# EAGLE design rgb_driver_double_layer (EAGLE 9.6.2)
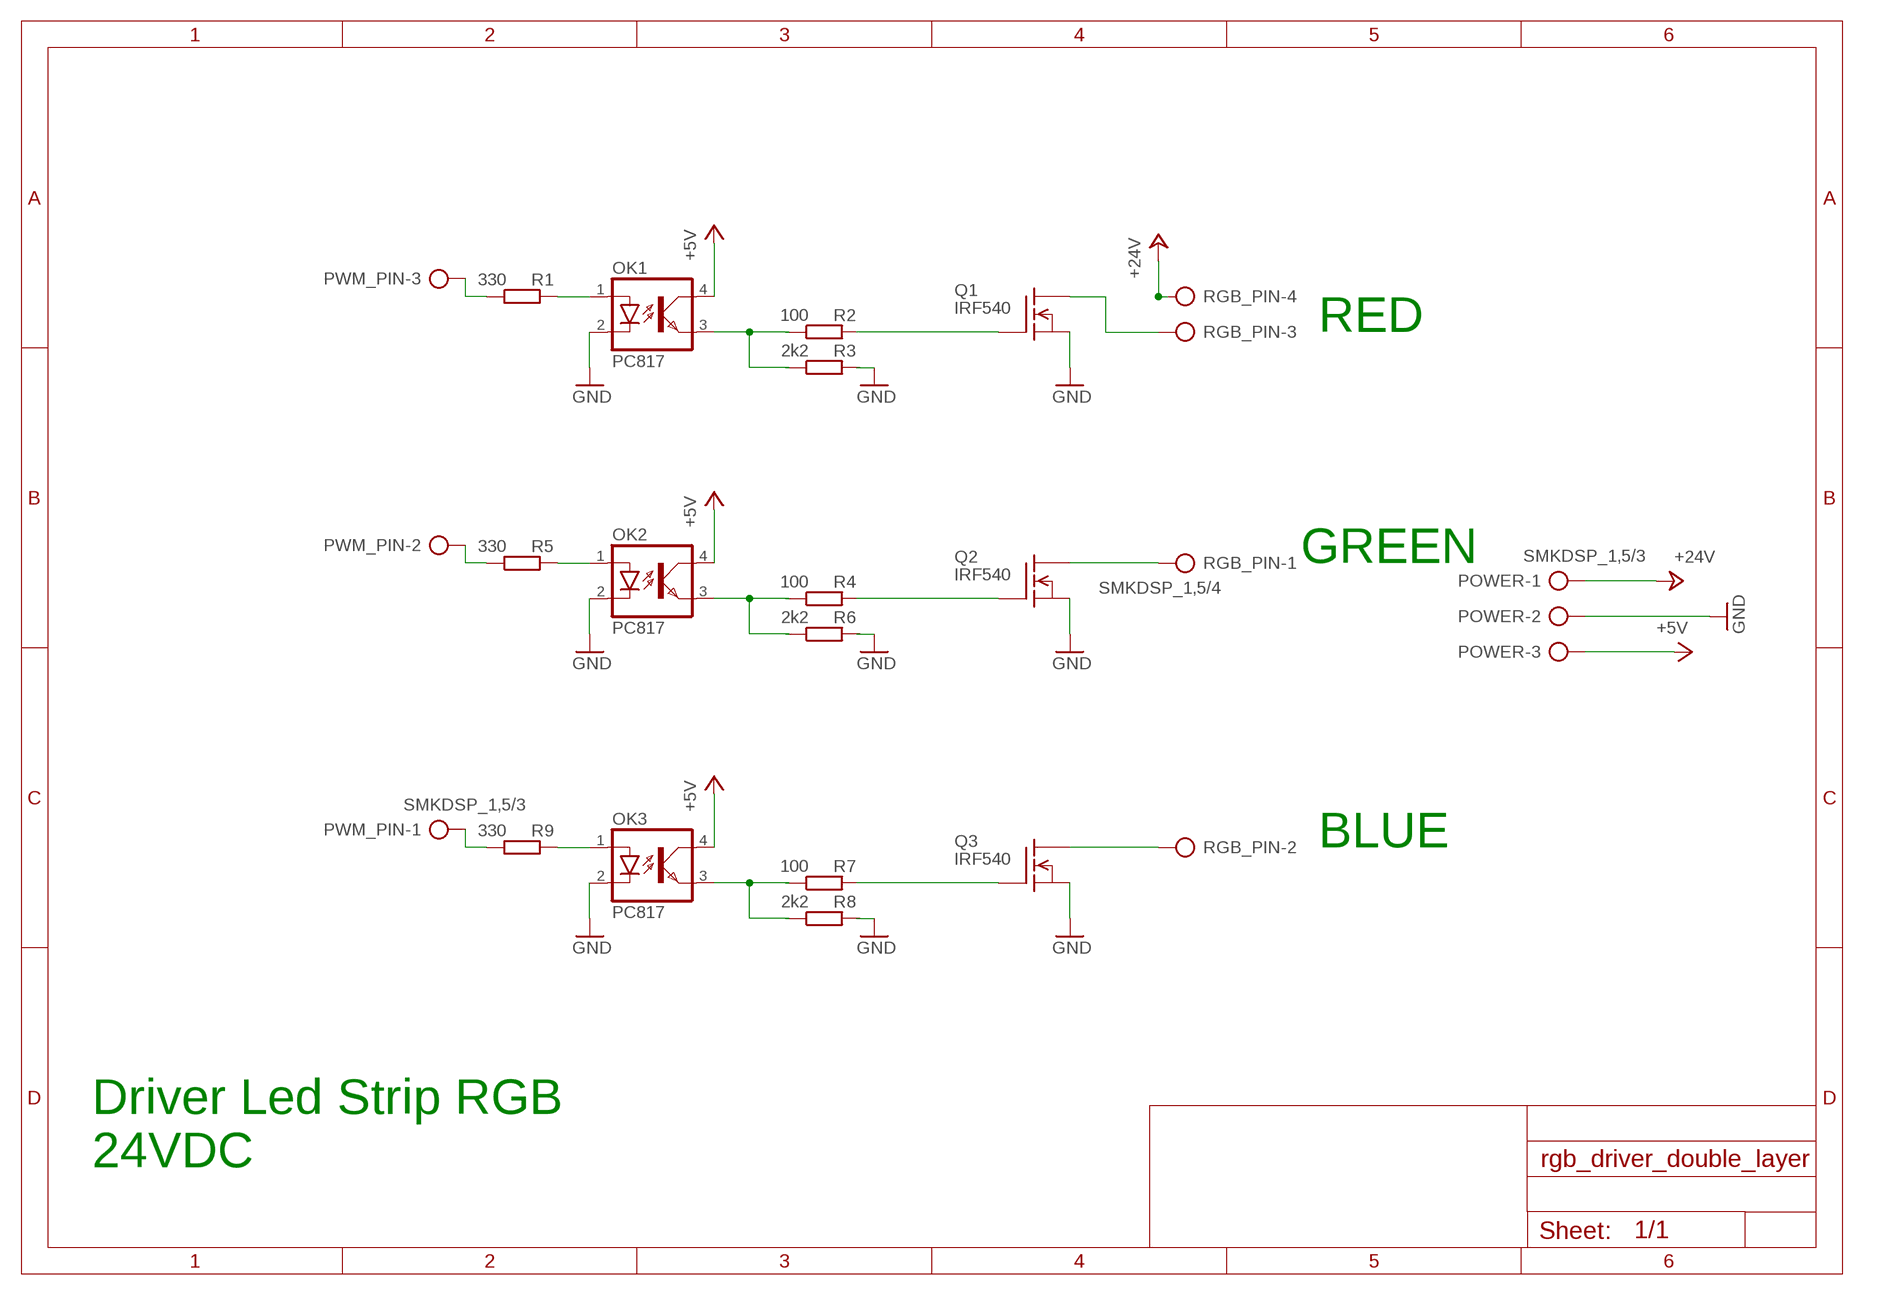
[diagram p0: schematic, sheet 1]

## Parts
OK1  PC817  [DIL04]
OK2  PC817  [DIL04]
OK3  PC817  [DIL04]
POWER  SMKDSP_1,5/3  [SMKDSP_1,5/3]
PWM_PIN  SMKDSP_1,5/3  [SMKDSP_1,5/3]
Q1  IRF540  [TO220]
Q2  IRF540  [TO220]
Q3  IRF540  [TO220]
R1  330  R-EU_0207/10  [0207/10]
R2  100  R-EU_0207/10  [0207/10]
R3  2k2  R-EU_0207/10  [0207/10]
R4  100  R-EU_0207/10  [0207/10]
R5  330  R-EU_0207/10  [0207/10]
R6  2k2  R-EU_0207/10  [0207/10]
R7  100  R-EU_0207/10  [0207/10]
R8  2k2  R-EU_0207/10  [0207/10]
R9  330  R-EU_0207/10  [0207/10]
RGB_PIN  SMKDSP_1,5/4  [SMKDSP_1,5/4]

## Nets
+5V: OK1.4(COL) OK2.4(COL) OK3.4(COL) POWER.3
+24V: POWER.1 RGB_PIN.4
BLUE_LED: Q3.2(D) RGB_PIN.2
GND: OK1.2(C) OK2.2(C) OK3.2(C) POWER.2 Q1.3(S) Q2.3(S) Q3.3(S) R3.2 R6.2 R8.2
GREEN_LED: Q2.2(D) RGB_PIN.1
N$1: OK1.3(EMIT) R2.1 R3.1
N$3: Q1.1(G) R2.2
N$5: OK2.3(EMIT) R4.1 R6.1
N$8: Q2.1(G) R4.2
N$11: OK3.3(EMIT) R7.1 R8.1
N$13: Q3.1(G) R7.2
N$16: OK1.1(A) R1.2
N$17: OK2.1(A) R5.2
N$18: OK3.1(A) R9.2
PWM_BLUE: PWM_PIN.1 R9.1
PWM_GREEN: PWM_PIN.2 R5.1
PWM_RED: PWM_PIN.3 R1.1
RED_LED: Q1.2(D) RGB_PIN.3

## Notes on the sheet
- RED
- GREEN
- BLUE
- Driver Led Strip RGB
- 24VDC

## Library data of the parts
OK1-OK3 = optocoupler:PC817: SHARP OPTO COUPLER; MPN: PC817X4J000F; OC_FARNELL: 9707727; OC_NEWARK: 97K7059
POWER PWM_PIN = con-phoenix-smkdsp:SMKDSP_1,5/3: Printklemme, Nennstrom: 17,5 A, Bemessungsspannung: 250 V, Raster: 5,0 mm Source: http://eshop.phoenixcontact.de .. 1733415.pdf; MF: FARNELL; MPN: 1733583; OC_FARNELL: 3041256; OC_NEWARK: 71C4130
Q1-Q3 = transistor-fet:IRF540: N-Channel Enhancement MOSFET (HEXFET); 100V; 28A; 0,077Ohm
R1-R9 = resistor:R-EU_: RESISTOR, European symbol
RGB_PIN = con-phoenix-smkdsp:SMKDSP_1,5/4: Printklemme, Nennstrom: 17,5 A, Bemessungsspannung: 250 V, Raster: 5,0 mm Source: http://eshop.phoenixcontact.de .. 1733415.pdf; MF: FARNELL; MPN: 1733596; OC_FARNELL: 3041268; OC_NEWARK: 71C4131

## Board
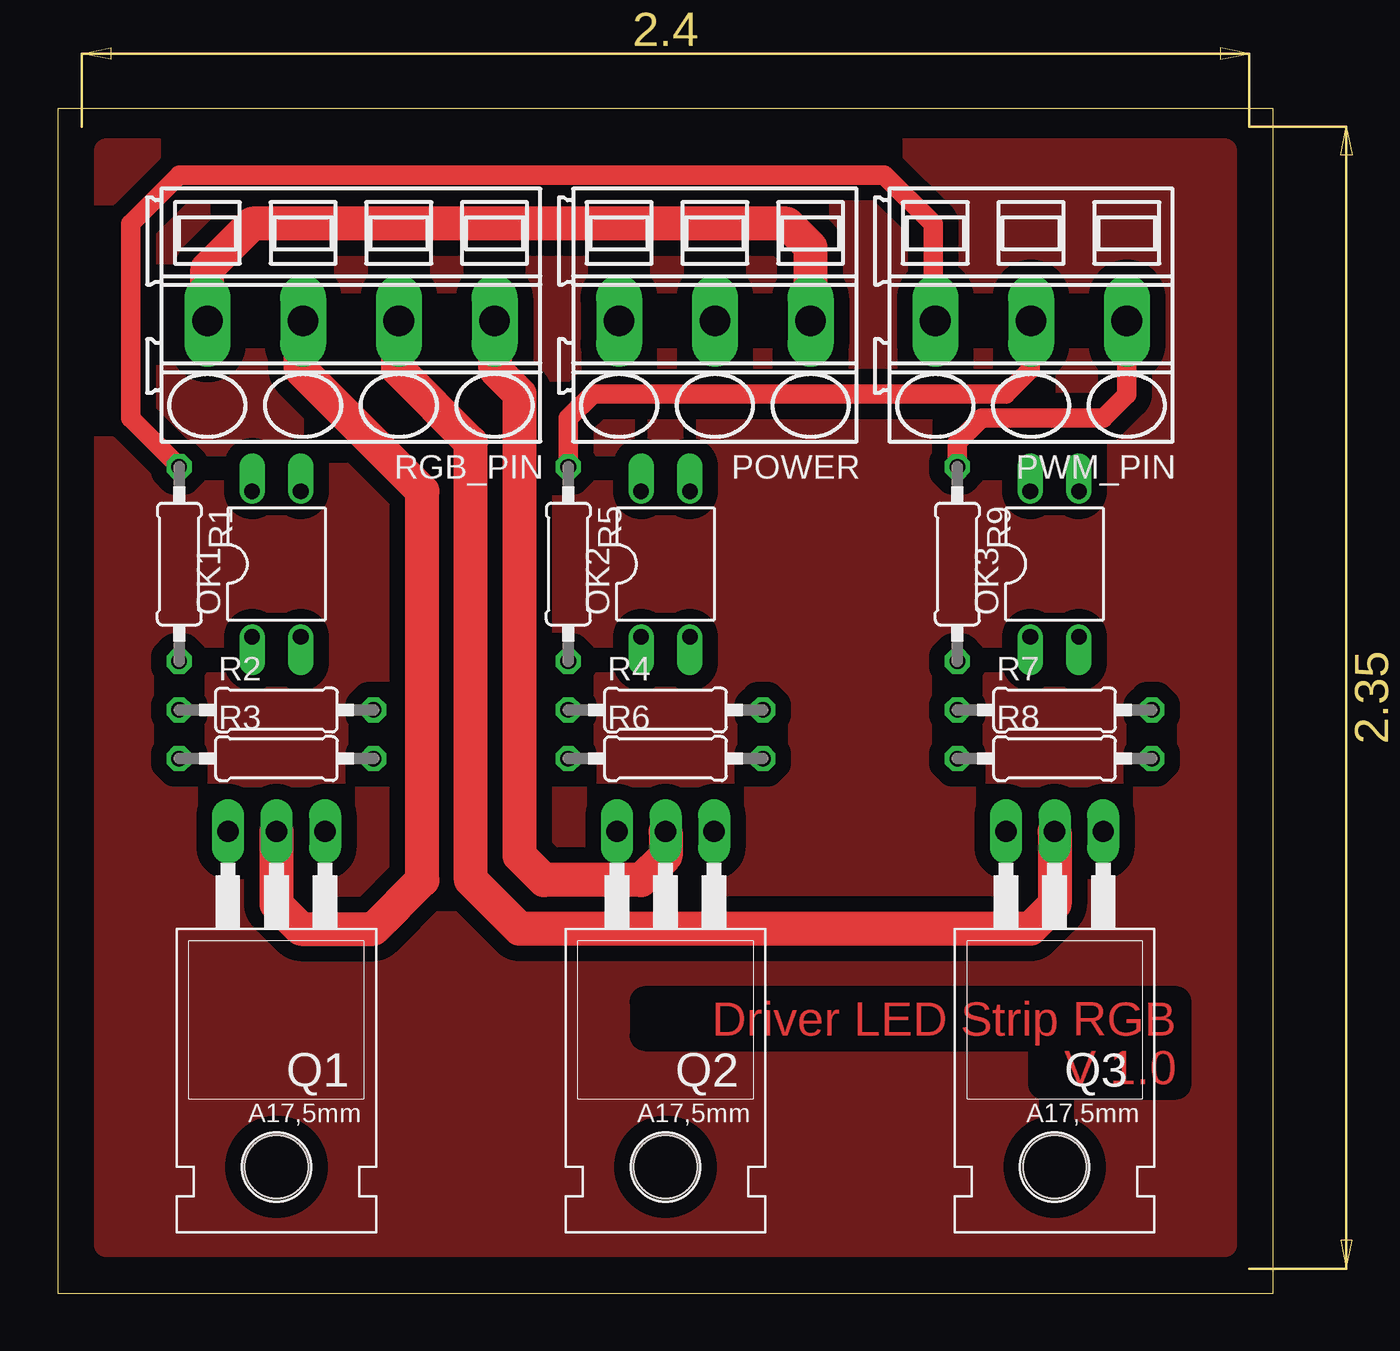
[diagram p1: board, top side]
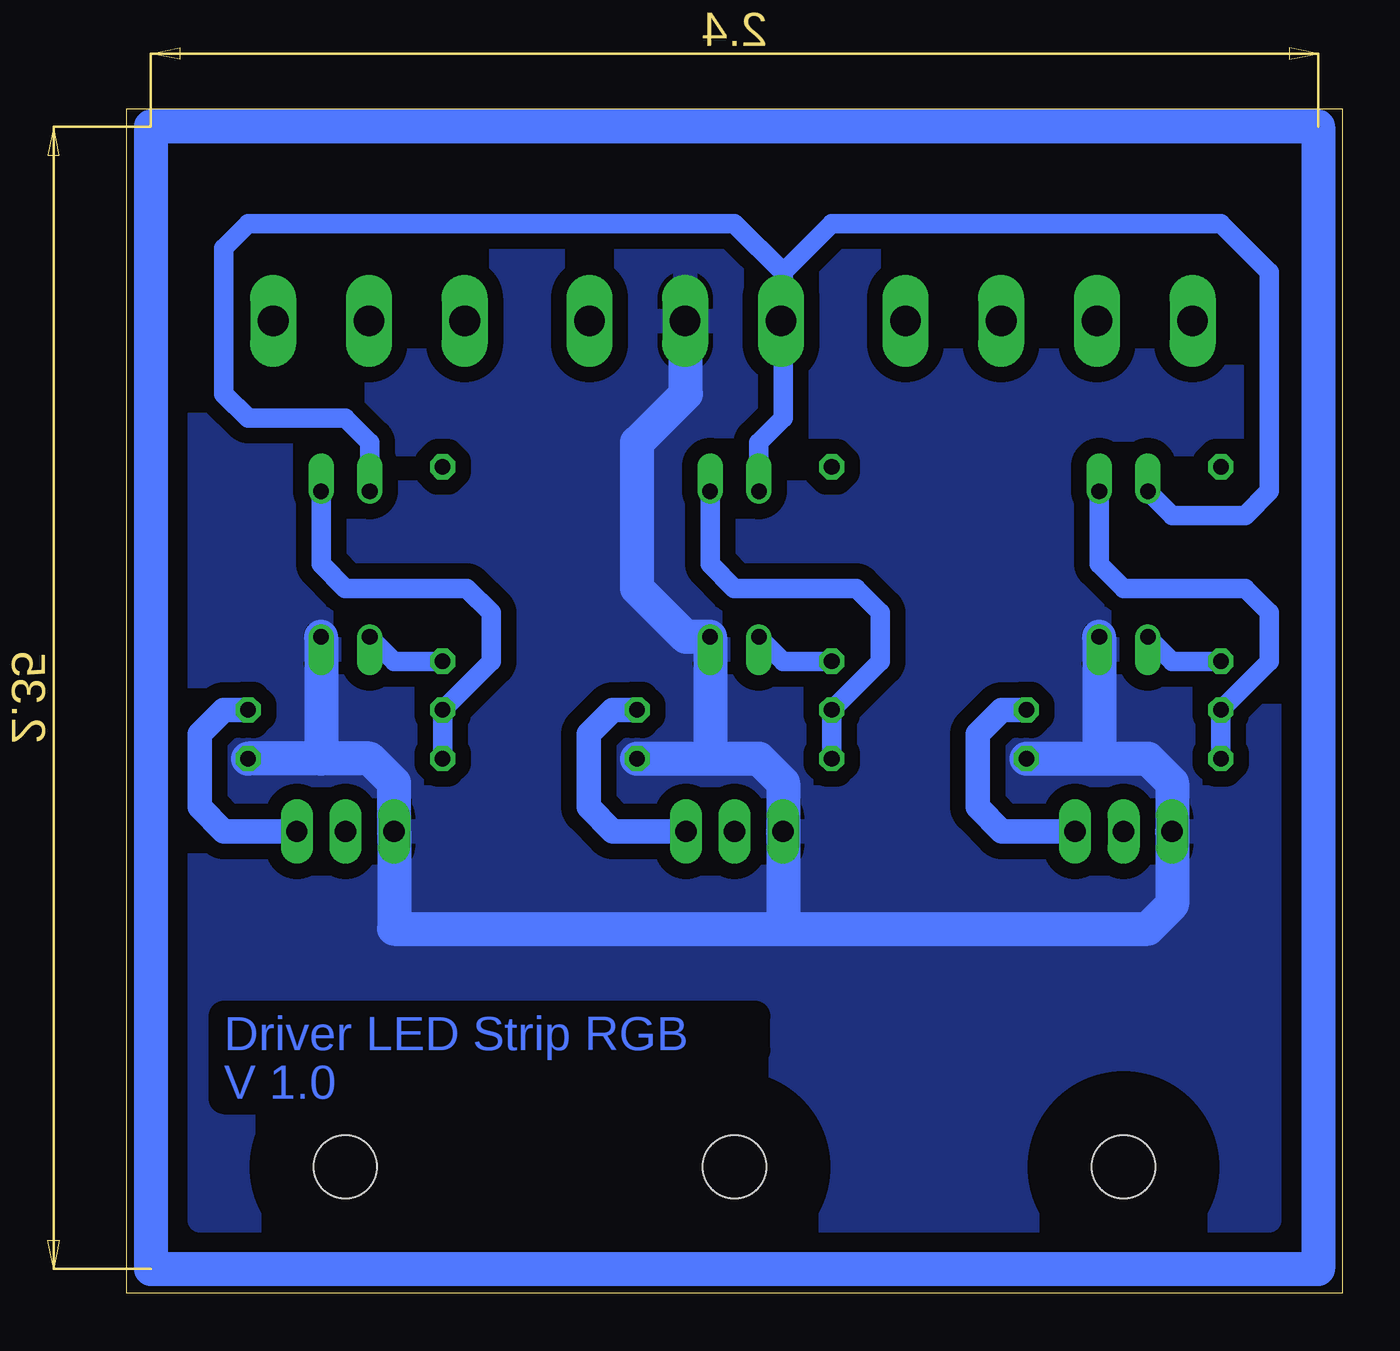
[diagram p2: board, bottom side, seen from below]

Size 63.48 x 61.9 mm. Coordinates in mm from the lower left corner, seen from the top.
Outline: 0,0 63.48,0 63.48,61.9 0,61.9 0,0
Copper layers (1*16): Top 0.035mm / dielectric 1.5mm / Bottom 0.035mm
Design rules "default": minimum track width 10mil, minimum drill 24mil, track to track 8mil, track to pad 8mil, pad to pad 8mil, via to via 8mil, smd to smd 8mil, copper to edge 40mil, drill to drill 8mil, minimum pad ring 10mil, minimum via ring 8mil, stop-mask expansion 4mil, vias tented up to drill 0mil, thermal gap 10mil

### Footprints (pad centres in the part's own frame; a part is rotated, then mirrored left to right if it is on the bottom)
DIL04 = drill 0.813 offset: 1 -1.27,-3.81; 2 1.27,-3.81; 3 1.27,3.81; 4 -1.27,3.81
SMKDSP_1,5/3 = drill 1.6 pad 1.8 long: 1 -2.5,0; 2 2.5,0; 3 7.5,0
TO220 = drill 1.118 long: 1 -2.54,-6.35; 2 0,-6.35; 3 2.54,-6.35 | hole 3.302: 0,11.176
0207/10 = drill 0.813 octagon: 1 -5.08,0; 2 5.08,0
SMKDSP_1,5/4 = drill 1.6 pad 1.8 long: 1 -2.5,0; 2 2.5,0; 3 7.5,0; 4 12.5,0

### Placement (x,y rotation side)
OK1  11.43,38.1 0 top
OK2  31.75,38.1 0 top
OK3  52.07,38.1 0 top
POWER  36.83,50.8 180 top
PWM_PIN  53.34,50.8 180 top
Q1  11.43,17.78 180 top
Q2  31.75,17.78 180 top
Q3  52.07,17.78 180 top
R1  6.35,38.1 270 top
R2  11.43,30.48 0 top
R3  11.43,27.94 0 top
R4  31.75,30.48 0 top
R5  26.67,38.1 270 top
R6  31.75,27.94 0 top
R7  52.07,30.48 0 top
R8  52.07,27.94 0 top
R9  46.99,38.1 270 top
RGB_PIN  20.32,50.8 180 top

### Tracks (layer width: path | path; a pad name or v marks a point on that pad's centre or on a via)
+5V
  Bottom 1.016: OK2.4 30.48,44.45 29.21,45.72 29.21,50.68 POWER.3 29.21,50.92 29.21,53.34 | OK3.4 50.8,44.45 52.07,45.72 57.15,45.72 58.42,46.99 58.42,54.61 57.15,55.88 31.75,55.88 29.21,53.34 | OK1.4 8.89,40.64 5.08,40.64 3.81,41.91 3.81,53.34 6.35,55.88 26.67,55.88 29.21,53.34
+24V
  Top 1.778: RGB_PIN.4 7.82,53.54 10.16,55.88 38.1,55.88 39.33,54.65 POWER.1
BLUE_LED
  Top 1.778: Q3.2 52.07,20.32 50.8,19.05 24.13,19.05 21.59,21.59 21.59,44.45 17.78,48.26 17.78,50.76 RGB_PIN.2
GND
  Bottom 1.778: 12.7,27.94 10.16,27.94 8.89,26.67 Q1.3 8.89,20.32 10.16,19.05 29.21,19.05 | OK1.2 12.7,27.94 | 33.02,27.94 OK2.2 34.29,34.29 36.83,36.83 36.83,44.45 34.29,46.99 34.29,50.76 POWER.2 | 33.02,27.94 30.48,27.94 29.21,26.67 Q2.3 29.21,19.05 | R6.2 33.02,27.94 | R3.2 12.7,27.94 | 29.21,19.05 49.53,19.05 Q3.3 49.53,26.67 50.8,27.94 53.34,27.94 | 53.34,27.94 R8.2 | OK3.2 53.34,27.94
  pour Bottom (isolate 0.813): 5.08,58.42 59.69,58.42 59.69,3.81 3.81,3.81 3.81,58.42
GREEN_LED
  Top 1.778: Q2.2 31.75,22.86 30.48,21.59 25.4,21.59 24.13,22.86 24.13,46.99 22.86,48.26 22.86,50.8 RGB_PIN.1
N$1
  Bottom 1.016: OK1.3 12.7,38.1 11.43,36.83 5.08,36.83 3.81,35.56 3.81,33.02 R2.1 R3.1
N$2
  Bottom 1.778: 1.27,60.96 62.23,60.96 62.23,1.27 1.27,1.27 1.27,60.96
N$3
  Bottom 1.27: R2.2 17.78,30.48 19.05,29.21 19.05,25.4 17.78,24.13 15.24,24.13 Q1.1
N$5
  Bottom 1.016: OK2.3 33.02,38.1 31.75,36.83 25.4,36.83 24.13,35.56 24.13,33.02 R4.1 R6.1
N$8
  Bottom 1.27: R4.2 38.1,30.48 39.37,29.21 39.37,25.4 38.1,24.13 Q2.1
N$11
  Bottom 1.016: OK3.3 53.34,38.1 52.07,36.83 45.72,36.83 44.45,35.56 44.45,33.02 R7.1 R8.1
N$12
  pour Top (isolate 0.813): 3.81,59.69 60.96,59.69 60.96,2.54 2.54,2.54 2.54,59.69
N$13
  Bottom 1.27: R7.2 58.42,30.48 59.69,29.21 59.69,25.4 58.42,24.13 Q3.1
N$16
  Bottom 1.016: R1.2 8.89,33.02 OK1.1
N$17
  Bottom 1.016: R5.2 29.21,33.02 OK2.1
N$18
  Bottom 1.016: R9.2 49.53,33.02 OK3.1
PWM_BLUE
  Top 1.016: PWM_PIN.1 55.84,46.95 54.61,45.72 48.26,45.72 46.99,44.45 R9.1
PWM_GREEN
  Top 1.016: R5.1 26.67,45.72 27.94,46.99 49.53,46.99 50.8,48.26 50.8,50.76 PWM_PIN.2
PWM_RED
  Top 1.016: R1.1 3.81,45.72 3.81,55.88 6.35,58.42 43.18,58.42 45.72,55.88 45.72,50.92 PWM_PIN.3
RED_LED
  Top 1.778: Q1.2 11.43,20.32 12.7,19.05 16.51,19.05 19.05,21.59 19.05,41.91 12.7,48.26 12.7,50.68 RGB_PIN.3

### Text on the board
Top: Driver LED Strip RGB | V 1.0
Bottom: Driver LED Strip RGB | V 1.0